# Altium schematic sheet pcuAI.SchDoc
size A3
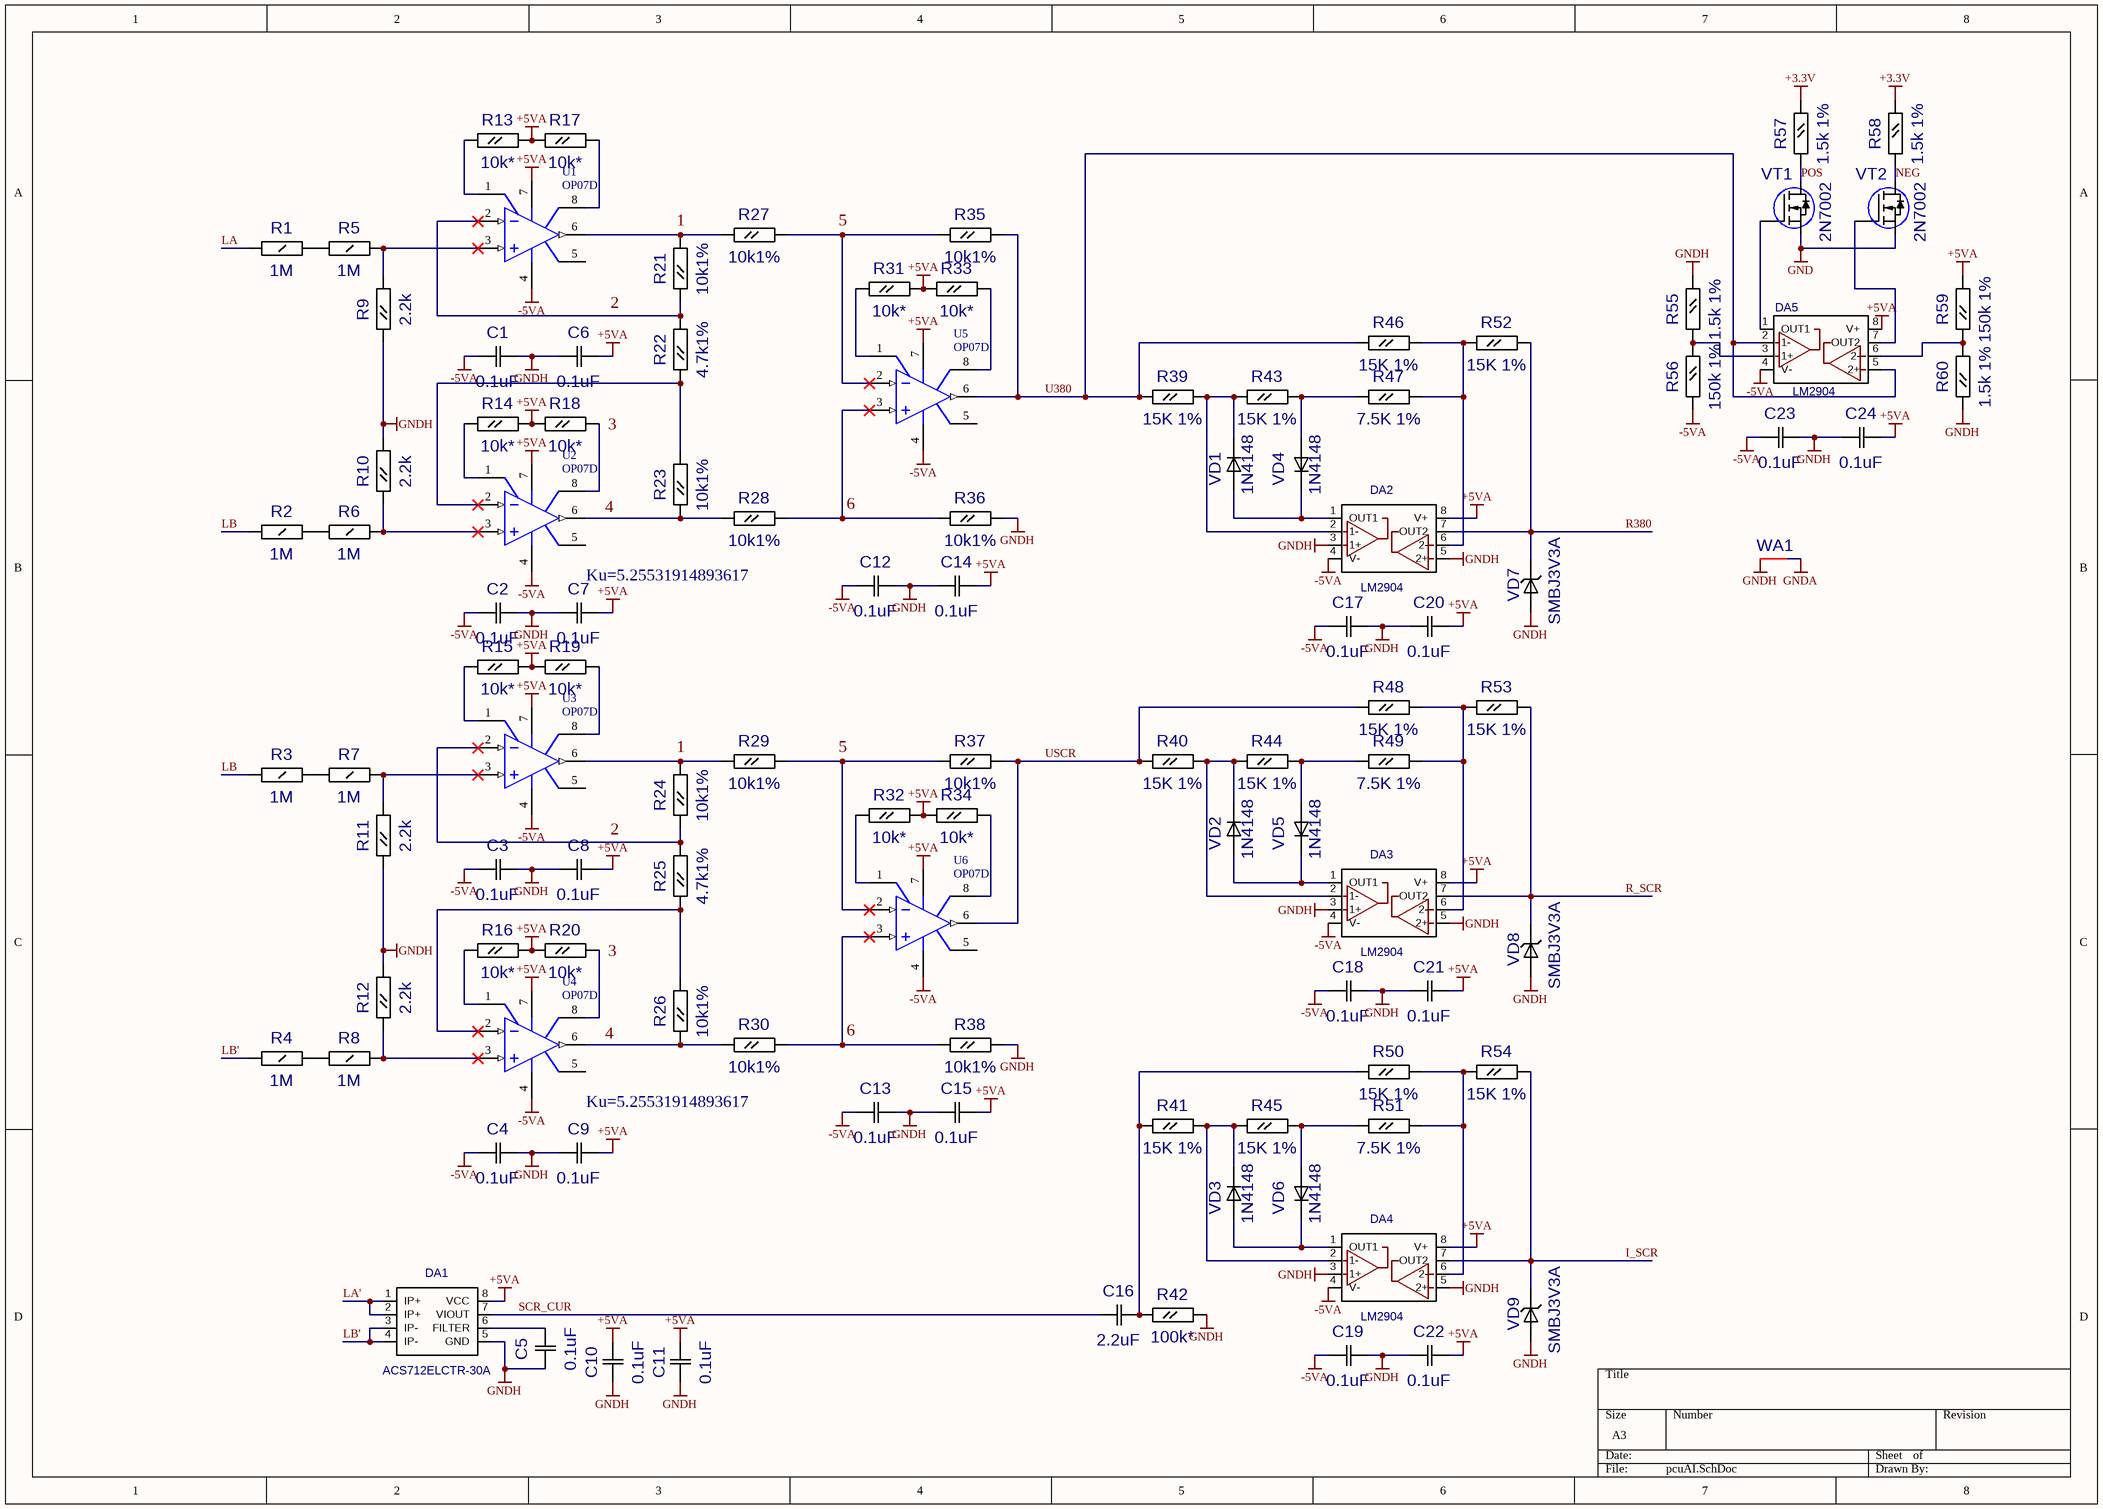
[diagram p0: pcuAI.SchDoc]

## Parts
C1  value 0.1uF  [C0805]  (hidden comment: C0805)
C2  value 0.1uF  [C0805]  (hidden comment: C0805)
C3  value 0.1uF  [C0805]  (hidden comment: C0805)
C4  value 0.1uF  [C0805]  (hidden comment: C0805)
C5  value 0.1uF  [C0805]  (hidden comment: C0805)
C6  value 0.1uF  [C0805]  (hidden comment: C0805)
C7  value 0.1uF  [C0805]  (hidden comment: C0805)
C8  value 0.1uF  [C0805]  (hidden comment: C0805)
C9  value 0.1uF  [C0805]  (hidden comment: C0805)
C10  value 0.1uF  [C0805]  (hidden comment: C0805)
C11  value 0.1uF  [C0805]  (hidden comment: C0805)
C12  value 0.1uF  [C0805]  (hidden comment: C0805)
C13  value 0.1uF  [C0805]  (hidden comment: C0805)
C14  value 0.1uF  [C0805]  (hidden comment: C0805)
C15  value 0.1uF  [C0805]  (hidden comment: C0805)
C16  value 2.2uF  [C0805]  (hidden comment: C0805)
C17  value 0.1uF  [C0805]  (hidden comment: C0805)
C18  value 0.1uF  [C0805]  (hidden comment: C0805)
C19  value 0.1uF  [C0805]  (hidden comment: C0805)
C20  value 0.1uF  [C0805]  (hidden comment: C0805)
C21  value 0.1uF  [C0805]  (hidden comment: C0805)
C22  value 0.1uF  [C0805]  (hidden comment: C0805)
C23  value 0.1uF  [C0805]  (hidden comment: C0805)
C24  value 0.1uF  [C0805]  (hidden comment: C0805)
DA1  ACS712ELCTR-30A  [SO8-1.27]
DA2  LM2904  [SO8-1.27]
DA3  LM2904  [SO8-1.27]
DA4  LM2904  [SO8-1.27]
DA5  LM2904  [SO8-1.27]
R1  value 1M  [R1206]  (hidden comment: R1206)
R2  value 1M  [R1206]  (hidden comment: R1206)
R3  value 1M  [R1206]  (hidden comment: R1206)
R4  value 1M  [R1206]  (hidden comment: R1206)
R5  value 1M  [R1206]  (hidden comment: R1206)
R6  value 1M  [R1206]  (hidden comment: R1206)
R7  value 1M  [R1206]  (hidden comment: R1206)
R8  value 1M  [R1206]  (hidden comment: R1206)
R9  value 2.2k  [R0805]  (hidden comment: R0805)
R10  value 2.2k  [R0805]  (hidden comment: R0805)
R11  value 2.2k  [R0805]  (hidden comment: R0805)
R12  value 2.2k  [R0805]  (hidden comment: R0805)
R13  value 10k*  [R0805]  (hidden comment: R0805)
R14  value 10k*  [R0805]  (hidden comment: R0805)
R15  value 10k*  [R0805]  (hidden comment: R0805)
R16  value 10k*  [R0805]  (hidden comment: R0805)
R17  value 10k*  [R0805]  (hidden comment: R0805)
R18  value 10k*  [R0805]  (hidden comment: R0805)
R19  value 10k*  [R0805]  (hidden comment: R0805)
R20  value 10k*  [R0805]  (hidden comment: R0805)
R21  value 10k1%  [R0805]  (hidden comment: R0805)
R22  value 4.7k1%  [R0805]  (hidden comment: R0805)
R23  value 10k1%  [R0805]  (hidden comment: R0805)
R24  value 10k1%  [R0805]  (hidden comment: R0805)
R25  value 4.7k1%  [R0805]  (hidden comment: R0805)
R26  value 10k1%  [R0805]  (hidden comment: R0805)
R27  value 10k1%  [R0805]  (hidden comment: R0805)
R28  value 10k1%  [R0805]  (hidden comment: R0805)
R29  value 10k1%  [R0805]  (hidden comment: R0805)
R30  value 10k1%  [R0805]  (hidden comment: R0805)
R31  value 10k*  [R0805]  (hidden comment: R0805)
R32  value 10k*  [R0805]  (hidden comment: R0805)
R33  value 10k*  [R0805]  (hidden comment: R0805)
R34  value 10k*  [R0805]  (hidden comment: R0805)
R35  value 10k1%  [R0805]  (hidden comment: R0805)
R36  value 10k1%  [R0805]  (hidden comment: R0805)
R37  value 10k1%  [R0805]  (hidden comment: R0805)
R38  value 10k1%  [R0805]  (hidden comment: R0805)
R39  value 15K 1%  [R0805]  (hidden comment: R0805)
R40  value 15K 1%  [R0805]  (hidden comment: R0805)
R41  value 15K 1%  [R0805]  (hidden comment: R0805)
R42  value 100k*  [R0805]  (hidden comment: R0805)
R43  value 15K 1%  [R0805]  (hidden comment: R0805)
R44  value 15K 1%  [R0805]  (hidden comment: R0805)
R45  value 15K 1%  [R0805]  (hidden comment: R0805)
R46  value 15K 1%  [R0805]  (hidden comment: R0805)
R47  value 7.5K 1%  [R0805]  (hidden comment: R0805)
R48  value 15K 1%  [R0805]  (hidden comment: R0805)
R49  value 7.5K 1%  [R0805]  (hidden comment: R0805)
R50  value 15K 1%  [R0805]  (hidden comment: R0805)
R51  value 7.5K 1%  [R0805]  (hidden comment: R0805)
R52  value 15K 1%  [R0805]  (hidden comment: R0805)
R53  value 15K 1%  [R0805]  (hidden comment: R0805)
R54  value 15K 1%  [R0805]  (hidden comment: R0805)
R55  value 1.5k 1%  [R0805]  (hidden comment: R0805)
R56  value 150k 1%  [R0805]  (hidden comment: R0805)
R57  value 1.5k 1%  [R0805]  (hidden comment: R0805)
R58  value 1.5k 1%  [R0805]  (hidden comment: R0805)
R59  value 150k 1%  [R0805]  (hidden comment: R0805)
R60  value 1.5k 1%  [R0805]  (hidden comment: R0805)
U1  OP07D  [SO8-1.27]
U2  OP07D  [SO8-1.27]
U3  OP07D  [SO8-1.27]
U4  OP07D  [SO8-1.27]
U5  OP07D  [SO8-1.27]
U6  OP07D  [SO8-1.27]
VD1  value 1N4148  [SOD123]  (hidden comment: DIOD_thin)
VD2  value 1N4148  [SOD123]  (hidden comment: DIOD_thin)
VD3  value 1N4148  [SOD123]  (hidden comment: DIOD_thin)
VD4  value 1N4148  [SOD123]  (hidden comment: DIOD_thin)
VD5  value 1N4148  [SOD123]  (hidden comment: DIOD_thin)
VD6  value 1N4148  [SOD123]  (hidden comment: DIOD_thin)
VD7  value SMBJ3V3A  [DO-214AA(SMB)]  (hidden comment: 10BQ100)
VD8  value SMBJ3V3A  [DO-214AA(SMB)]  (hidden comment: 10BQ100)
VD9  value SMBJ3V3A  [DO-214AA(SMB)]  (hidden comment: 10BQ100)
VT1  2N7002  [SOT23-1]
VT2  2N7002  [SOT23-1]
WA1  Net connector  [Net connector]  (value not drawn)  (net tie, no BOM)

## Nets
+3.3V: R57.2 R58.2
+5VA: C6.2 C7.2 C8.2 C9.2 C10.2 C11.2 C14.2 C15.2 C20.2 C21.2 C22.2 C24.2 DA1.8(VCC) DA2.8(V+) DA3.8(V+) DA4.8(V+) DA5.8(V+) R13.1 R14.1 R15.1 R16.1 R17.2 R18.2 R19.2 R20.2 R31.1 R32.1 R33.2 R34.2 R59.1 U1.7(V+) U2.7(V+) U3.7(V+) U4.7(V+) U5.7(V+) U6.7(V+)
-5VA: C1.1 C2.1 C3.1 C4.1 C12.1 C13.1 C17.1 C18.1 C19.1 C23.1 DA2.4(V-) DA3.4(V-) DA4.4(V-) DA5.4(V-) R56.1 U1.4(V-) U2.4(V-) U3.4(V-) U4.4(V-) U5.4(V-) U6.4(V-)
GND: VT1.2(S) VT2.2(S)
GNDA: WA1.1
GNDH: C1.2 C2.2 C3.2 C4.2 C5.1 C6.1 C7.1 C8.1 C9.1 C10.1 C11.1 C12.2 C13.2 C14.1 C15.1 C17.2 C18.2 C19.2 C20.1 C21.1 C22.1 C23.2 C24.1 DA1.5(GND) DA2.3(1+) DA2.5(2+) DA3.3(1+) DA3.5(2+) DA4.3(1+) DA4.5(2+) R9.2 R10.1 R11.2 R12.1 R36.1 R38.1 R42.1 R55.2 R60.2 VD7.2 VD8.2 VD9.2 WA1.2
I_SCR: DA4.7(OUT2) R54.1 VD9.1
LA: R1.2
LA': DA1.1(IP+) DA1.2(IP+)
LB: R2.2 R3.2
LB': DA1.3(IP-) DA1.4(IP-) R4.2
NEG: R58.1 VT2.3(D)
POS: R57.1 VT1.3(D)
R380: DA2.7(OUT2) R52.1 VD7.1
R_SCR: DA3.7(OUT2) R53.1 VD8.1
SCR_CUR: C16.1 DA1.7(VIOUT)
U380: DA5.2(1-) DA5.5(2+) R35.1 R39.2 R46.2 U5.6(OUT)
USCR: R37.1 R40.2 R48.2 U6.6(OUT)
NetC5_2: C5.2 DA1.6(FILTER)
NetC16_2: C16.2 R41.2 R42.2 R50.2
NetDA2_1: DA2.1(OUT1) VD1.2(+) VD4.1(-)
NetDA2_2: DA2.2(1-) R39.1 R43.2 VD1.1(-)
NetDA2_6: DA2.6(2-) R46.1 R47.1 R52.2
NetDA3_1: DA3.1(OUT1) VD2.2(+) VD5.1(-)
NetDA3_2: DA3.2(1-) R40.1 R44.2 VD2.1(-)
NetDA3_6: DA3.6(2-) R48.1 R49.1 R53.2
NetDA4_1: DA4.1(OUT1) VD3.2(+) VD6.1(-)
NetDA4_2: DA4.2(1-) R41.1 R45.2 VD3.1(-)
NetDA4_6: DA4.6(2-) R50.1 R51.1 R54.2
NetDA5_1: DA5.1(OUT1) VT1.1(G)
NetDA5_3: DA5.3(1+) R55.1 R56.2
NetDA5_6: DA5.6(2-) R59.2 R60.1
NetDA5_7: DA5.7(OUT2) VT2.1(G)
NetR1_1: R1.1 R5.2
NetR2_1: R2.1 R6.2
NetR3_1: R3.1 R7.2
NetR4_1: R4.1 R8.2
NetR5_1: R5.1 R9.1 U1.3(IN+)
NetR6_1: R6.1 R10.2 U2.3(IN+)
NetR7_1: R7.1 R11.1 U3.3(IN+)
NetR8_1: R8.1 R12.2 U4.3(IN+)
NetR13_2: R13.2 U1.1(VOSTRIM)
NetR14_2: R14.2 U2.1(VOSTRIM)
NetR15_2: R15.2 U3.1(VOSTRIM)
NetR16_2: R16.2 U4.1(VOSTRIM)
NetR17_1: R17.1 U1.8(VOSTRIM)
NetR18_1: R18.1 U2.8(VOSTRIM)
NetR19_1: R19.1 U3.8(VOSTRIM)
NetR20_1: R20.1 U4.8(VOSTRIM)
NetR21_1: R21.1 R27.2 U1.6(OUT)
NetR21_2: R21.2 R22.1 U1.2(IN-)
NetR22_2: R22.2 R23.1 U2.2(IN-)
NetR23_2: R23.2 R28.2 U2.6(OUT)
NetR24_1: R24.1 R29.2 U3.6(OUT)
NetR24_2: R24.2 R25.1 U3.2(IN-)
NetR25_2: R25.2 R26.1 U4.2(IN-)
NetR26_2: R26.2 R30.2 U4.6(OUT)
NetR27_1: R27.1 R35.2 U5.2(IN-)
NetR28_1: R28.1 R36.2 U5.3(IN+)
NetR29_1: R29.1 R37.2 U6.2(IN-)
NetR30_1: R30.1 R38.2 U6.3(IN+)
NetR31_2: R31.2 U5.1(VOSTRIM)
NetR32_2: R32.2 U6.1(VOSTRIM)
NetR33_1: R33.1 U5.8(VOSTRIM)
NetR34_1: R34.1 U6.8(VOSTRIM)
NetR43_1: R43.1 R47.2 VD4.2(+)
NetR44_1: R44.1 R49.2 VD5.2(+)
NetR45_1: R45.1 R51.2 VD6.2(+)

Not connected (* = marked no-connect by the designer): U1 5(NC); U2 5(NC); U3 5(NC); U4 5(NC); U5 5(NC); U6 5(NC)

## Notes on the sheet
- (near R21) 1
- 5
- 2
- (near R18) 3
- 4
- 6
- Ku=5.25531914893617
- (near R24) 1
- (near R20) 3

## Library data of the parts
C1-C24 = C0805: RefDes2: {RefDes2}
DA1 = ACS713: Value: *
DA2-DA5 = LM2904: LM2903; Value: *
R1-R8 = R1206: RefDes2: {RefDes2}
R9-R60 = R0805: RefDes2: {RefDes2}
U1-U6 = OP07D: Ultra-Low Offset Voltage Operational Amplifier; Note: Pin 5 is not connected.; Published: 8-Jun-2000; LatestRevisionDate: 04-Mar-2005; LatestRevisionNote: Stylized 3D Model Added.; DatasheetVersion: 1992; PackageReference: N-8_A; Publisher: Altium Limited; PackageDescription: DIP; 8 Leads; Row Spacing 7.62 mm; Pitch 2.54 mm; Code_JEDEC: MO-001-AN; ComponentLink1Description: Manufacturer Link; ComponentLink1URL: http://www.analog.com/en/prod/0,,759_786_OP07%2C00.html; ComponentLink2Description: Datasheet; ComponentLink2URL: http://www.analog.com/UploadedFiles/Data_Sheets/39161232478959OP07_c.pdf
VD1-VD6 = DIOD_thin: DIOD 1N4148; RefDes2: {RefDes2}
VD7-VD9 = 10BQ100: RefDes2: {RefDes2}